# EAGLE design zxmod (EAGLE 9.6.1)
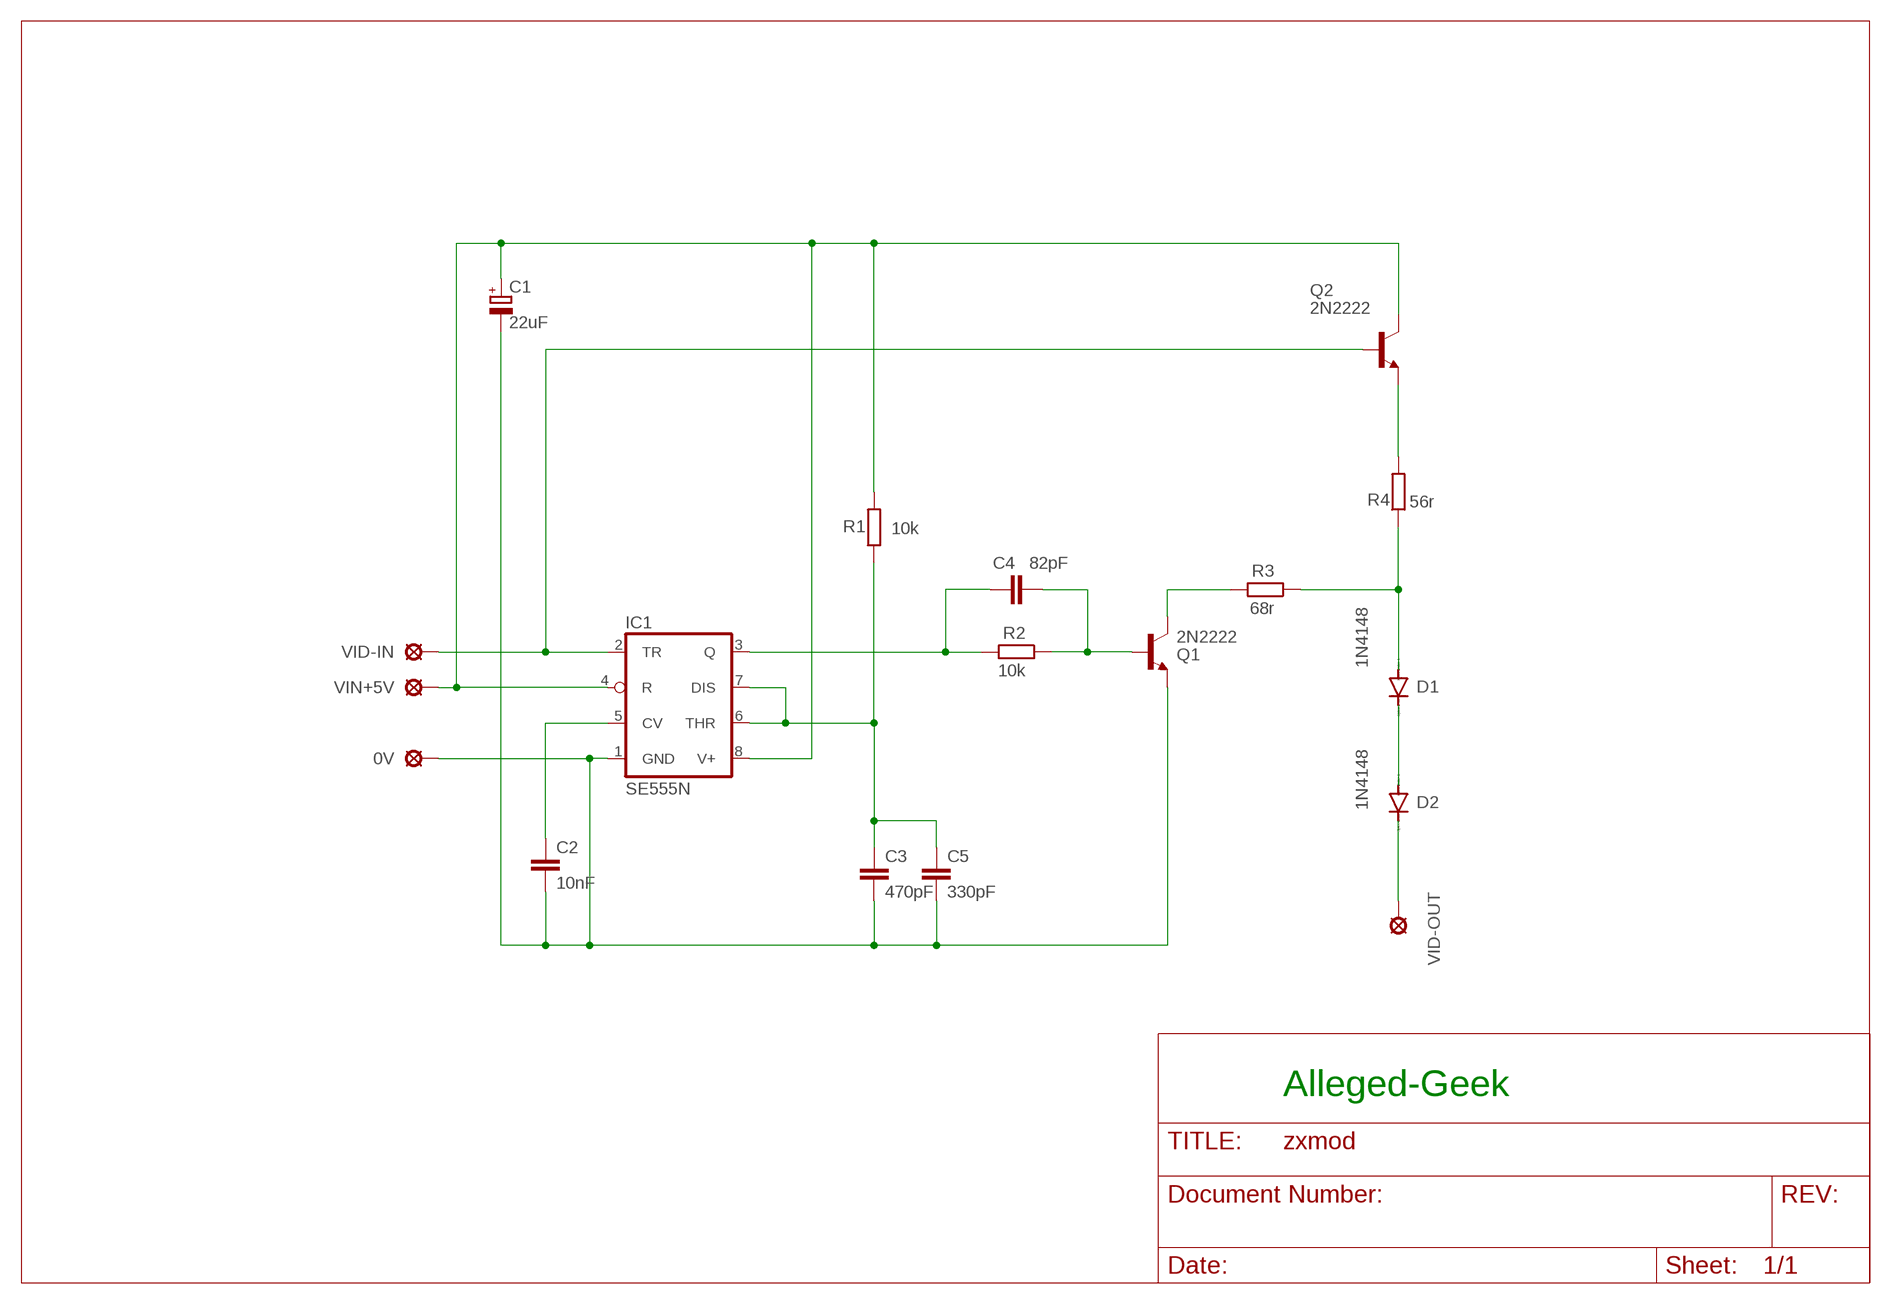
[diagram p0: schematic, sheet 1]

## Parts
0V  LSP10  [LSP10]
C1  22uF  CPOL-EUE2.5-5  [E2,5-5]
C2  10nF  C-EU050-030X075  [C050-030X075]
C3  470pF  C-EU025-024X044  [C025-024X044]
C4  82pF  C-EU025-025X050  [C025-025X050]
C5  330pF  C-EU025-024X044  [C025-024X044]
D1  1N4148  1N4148DO35-7  [DO35-7]
D2  1N4148  1N4148DO35-7  [DO35-7]
IC1  SE555N  [DIL08]
Q1  2N2222  [TO18]
Q2  2N2222  [TO18]
R1  10k  R-EU_0207/10  [0207/10]
R2  10k  R-EU_0207/10  [0207/10]
R3  68r  R-EU_0207/10  [0207/10]
R4  56r  R-EU_0207/10  [0207/10]
VID-IN  LSP10  [LSP10]
VID-OUT  LSP10  [LSP10]
VIN+5V  LSP10  [LSP10]

## Nets
0V: 0V.MP C1.- C2.2 C3.2 C5.2 IC1.1(GND) Q1.1(E)
N$1: C3.1 C5.1 IC1.6(THR) IC1.7(DIS) R1.1
N$2: C4.1 IC1.3(Q) R2.2
N$3: C4.2 Q1.2(B) R2.1
N$4: Q1.3(C) R3.2
N$5: D1.A R3.1 R4.1
N$6: D1.C D2.A
N$7: Q2.1(E) R4.2
N$9: C2.1 IC1.5(CV)
VID-IN: IC1.2(TR) Q2.2(B) VID-IN.MP
VID-OUT: D2.C VID-OUT.MP
VIN-5V: C1.+ IC1.4(R) IC1.8(V+) Q2.3(C) R1.2 VIN+5V.MP

## Notes on the sheet
- Alleged-Geek

## Library data of the parts
0V VID-IN VID-OUT VIN+5V = solpad:LSP10: SOLDER PAD drill 1.0 mm, distributor Buerklin, 12H555
C1 = rcl:CPOL-EU: POLARIZED CAPACITOR, European symbol; SPICEPREFIX: C
C2-C5 = rcl:C-EU: CAPACITOR, European symbol; SPICEPREFIX: C
D1 D2 = diode:1N4148: DIODE high speed (Philips)
IC1 = linear:*555: TIMER
Q1 Q2 = transistor-npn:2N2222*: NPN Transistor
R1-R4 = rcl:R-EU_: RESISTOR, European symbol; SPICEPREFIX: R

## Board
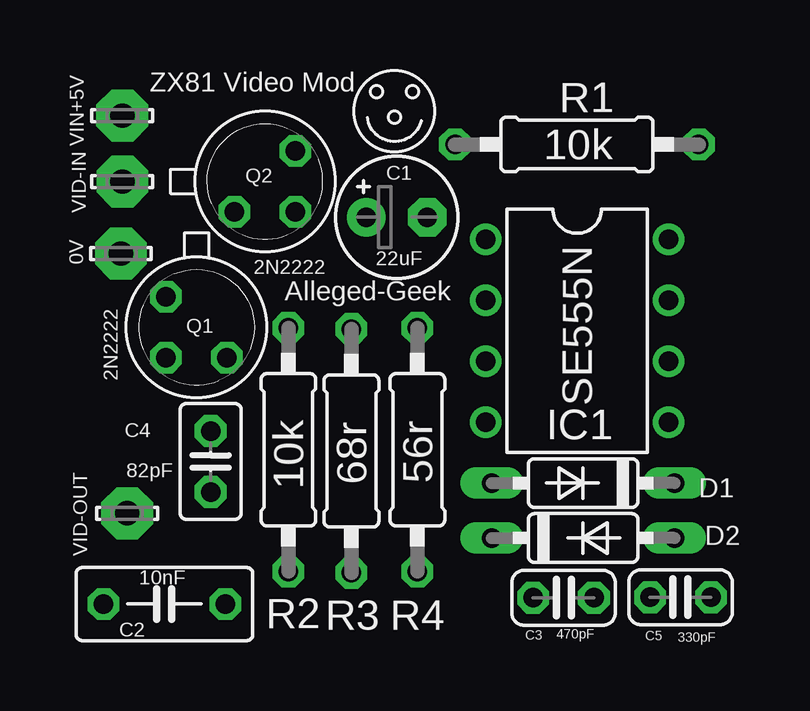
[diagram p1: board, top side]
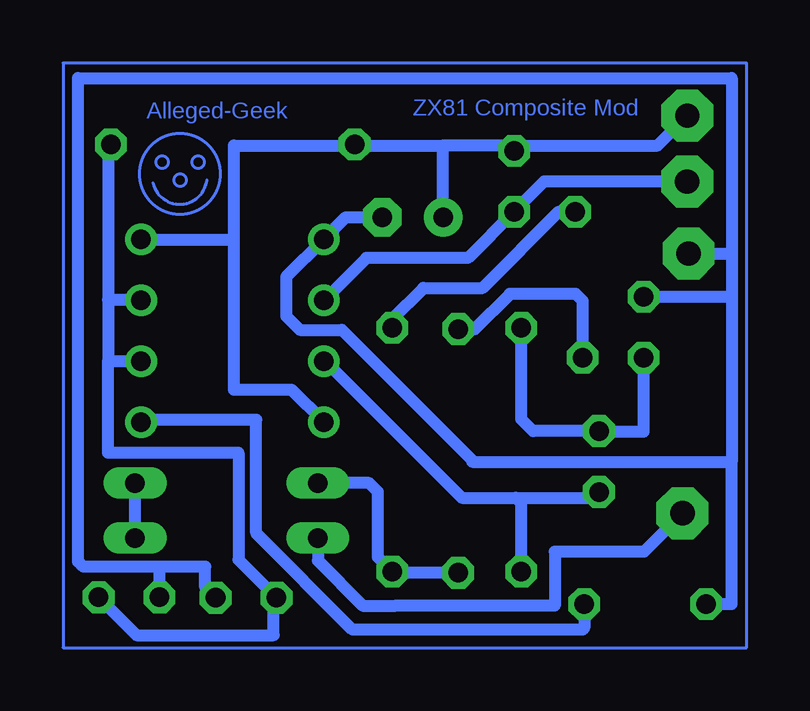
[diagram p2: board, bottom side, seen from below]

No outline drawn. Coordinates in mm, seen from the top.
Copper layers (1*16): Top 0.035mm / dielectric 1.5mm / Bottom 0.035mm
Design rules "default": minimum track width 6mil, minimum drill 0.35mm, track to track 6mil, track to pad 6mil, pad to pad 6mil, via to via 6mil, smd to smd 6mil, copper to edge 40mil, drill to drill 6mil, minimum pad ring 10mil, minimum via ring 8mil, stop-mask expansion 4mil, vias tented up to drill 0mil, thermal gap 10mil

### Footprints (pad centres in the part's own frame; a part is rotated, then mirrored left to right if it is on the bottom)
LSP10 = drill 1.016 pad 2.159 octagon: MP 0,0
E2,5-5 = drill 0.813 pad 1.6: + -1.27,0 | drill 0.813 pad 1.6 octagon: - 1.27,0
C050-030X075 = drill 0.813 octagon: 1 -2.54,0; 2 2.54,0
C025-024X044 = drill 0.813 octagon: 1 -1.27,0; 2 1.27,0
C025-025X050 = drill 0.813 octagon: 1 -1.27,0; 2 1.27,0
DO35-7 = drill 0.813 long: A 3.81,0; C -3.81,0
DIL08 = drill 0.813 pad 1.27: 1 -3.81,-3.81; 2 -1.27,-3.81; 3 1.27,-3.81; 4 3.81,-3.81; 5 3.81,3.81; 6 1.27,3.81; 7 -1.27,3.81; 8 -3.81,3.81
TO18 = drill 0.813 octagon: 1 -1.27,-1.27; 2 1.27,-1.27; 3 1.27,1.27
0207/10 = drill 0.813 octagon: 1 -5.08,0; 2 5.08,0

### Placement (x,y rotation side)
0V  16.04,32.43 0 top
C1  27.55,33.95 0 top
C2  17.86,17.82 180 top
C3  34.49,18.08 0 top
C4  19.78,23.76 90 top
C5  39.37,18.1 180 top
D1  35.31,22.86 180 top
D2  35.31,20.57 0 top
IC1  35.06,29.21 270 top
Q1  19.19,29.36 270 top
Q2  22.05,35.44 0 top
R1  35.05,36.98 180 top
R2  23.02,24.25 270 top
R3  25.65,24.2 90 top
R4  28.4,24.25 90 top
VID-IN  16.1,35.43 0 top
VID-OUT  16.3,21.6 0 top
VIN+5V  16.09,38.18 0 top

### Tracks (layer width: path | path; a pad name or v marks a point on that pad's centre or on a via)
0V
  Bottom 0.508: C1.- 30.32,33.95 IC1.1 32.82,31.45 32.82,29.82 32.25,29.25 30.5,29.25 25.06,23.81 25.06,23.75 14.25,23.75 | Q1.1 14.25,30.63 | 14.25,32.43 14.25,39.75 41.5,39.75 41.5,19.59 41.27,19.37 38.1,19.37 | 0V.MP 14.25,32.43 | 14.25,32.43 14.25,30.63 | 14.25,30.63 14.25,23.75 | C2.2 14.25,17.82 14.25,23.75 | C3.2 36.2,18.51 36.2,19.37 38.1,19.37 | C5.2 38.1,19.37
N$1
  Bottom 0.508: 40.25,27.94 IC1.6 | R1.1 40.25,36.86 40.25,30.5 | 40.25,30.5 40.25,27.94 | 40.25,27.94 40.25,24.12 34.81,24.12 34.81,19.66 C3.1 33.34,17.96 33.34,16.52 39.06,16.52 C5.1 | IC1.7 38.89,30.5 40.25,30.5
N$2
  Bottom 0.508: IC1.3 31.19,27.94 25.5,22.25 23.25,22.25 | 23.25,22.25 20.02,22.25 C4.1 | R2.2 23.02,22.02 23.25,22.25
N$3
  Bottom 0.508: Q1.2 17.92,25 19.75,25 C4.2 22.53,25.03 23.02,25.52 R2.1
N$4
  Bottom 0.508: Q1.3 20.46,30.46 20.75,30.75 23.5,30.75 24.97,29.28 R3.2
N$5
  Bottom 0.508: R3.1 28.35,19.12 R4.1 29,19.77 29,22.5 29.36,22.86 D1.A
N$6
  Bottom 0.508: D2.A D1.C
N$7
  Bottom 0.508: R4.2 28.4,29.7 27.11,31 24.62,31 21.45,34.17 Q2.1
N$8
  Bottom 0.127: 13.62,40.38 42.12,40.38 42.12,16 13.62,16 13.62,40.38
N$9
  Bottom 0.508: C2.1 20.39,16.82 20.46,16.75 30.04,16.75 34.07,20.77 34.07,25.5 38.77,25.5 IC1.5
N$10
  Bottom 0.127: 38.38,35.38 arc-161 36.12,35.5
VID-IN
  Bottom 0.508: VID-IN.MP 22.07,35.43 23.32,34.19 | Q2.2 23.32,34.19 | IC1.2 29.48,32.25 25.25,32.25 23.32,34.19
VID-OUT
  Bottom 0.508: VID-OUT.MP 17.9,20 21.62,20 21.62,17.75 28.26,17.75 29.63,17.75 31.5,19.62 D2.C
VIN-5V
  Bottom 0.508: IC1.4 32.6,26.75 35,26.75 35,33 | 35,33 35,36.93 30.02,36.93 R1.2 29.92,36.93 26.27,36.93 | IC1.8 35.02,33.02 35,33 | 16.16,38.25 VIN+5V.MP 17.34,36.93 23.32,36.93 | 23.32,36.93 26.27,36.93 | Q2.3 23.32,36.93 | C1.+ 26.27,36.93
(copper drawn outside any net)
  shapes: Bottom circle x4

### Text on the board
Bottom: ZX81 Composite Mod | Alleged-Geek
tPlace: ZX81 Video Mod | Alleged-Geek